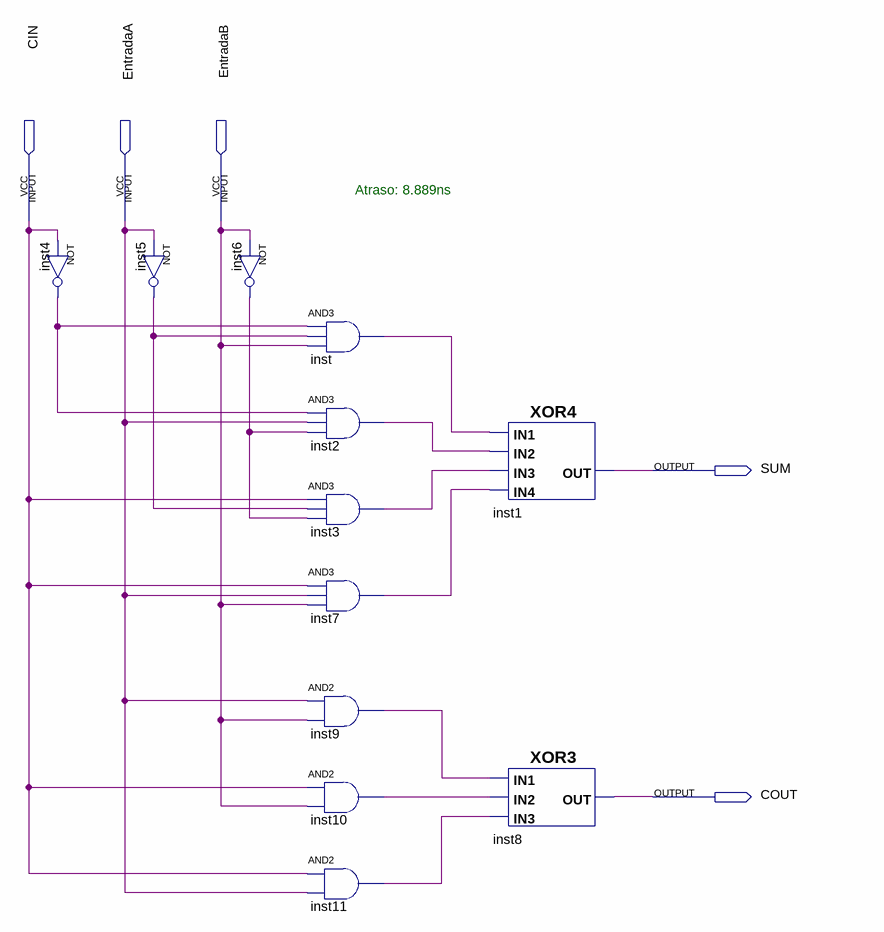
[diagram p0: schematic sheet]
// Quartus schematic FullAdder_1bit.bdf as structural Verilog: 12 symbols, 5 pins
module FullAdder_1bit (
  input  CIN,
  input  EntradaA,
  input  EntradaB,
  output SUM,
  output COUT
);

  wire inst2_out, inst3_out, inst4_out, inst5_out, inst6_out, inst7_out, inst9_out, inst10_out, inst11_out,
       inst_out;

  not inst4 (inst4_out, CIN);
  not inst5 (inst5_out, EntradaA);
  not inst6 (inst6_out, EntradaB);
  and inst (inst_out, inst4_out, inst5_out, EntradaB);
  and inst2 (inst2_out, inst4_out, EntradaA, inst6_out);
  and inst3 (inst3_out, CIN, inst5_out, inst6_out);
  and inst7 (inst7_out, CIN, EntradaA, EntradaB);
  and inst9 (inst9_out, EntradaA, EntradaB);
  and inst10 (inst10_out, CIN, EntradaB);
  and inst11 (inst11_out, CIN, EntradaA);
  XOR4 inst1 (.IN3(inst3_out), .IN4(inst7_out), .IN2(inst2_out), .IN1(inst_out), .OUT(SUM));
  XOR3 inst8 (.IN3(inst11_out), .IN1(inst9_out), .IN2(inst10_out), .OUT(COUT));

  // Notes on the sheet:
  //   Atraso: 8.889ns
endmodule
